# Altium project main.PrjPcb
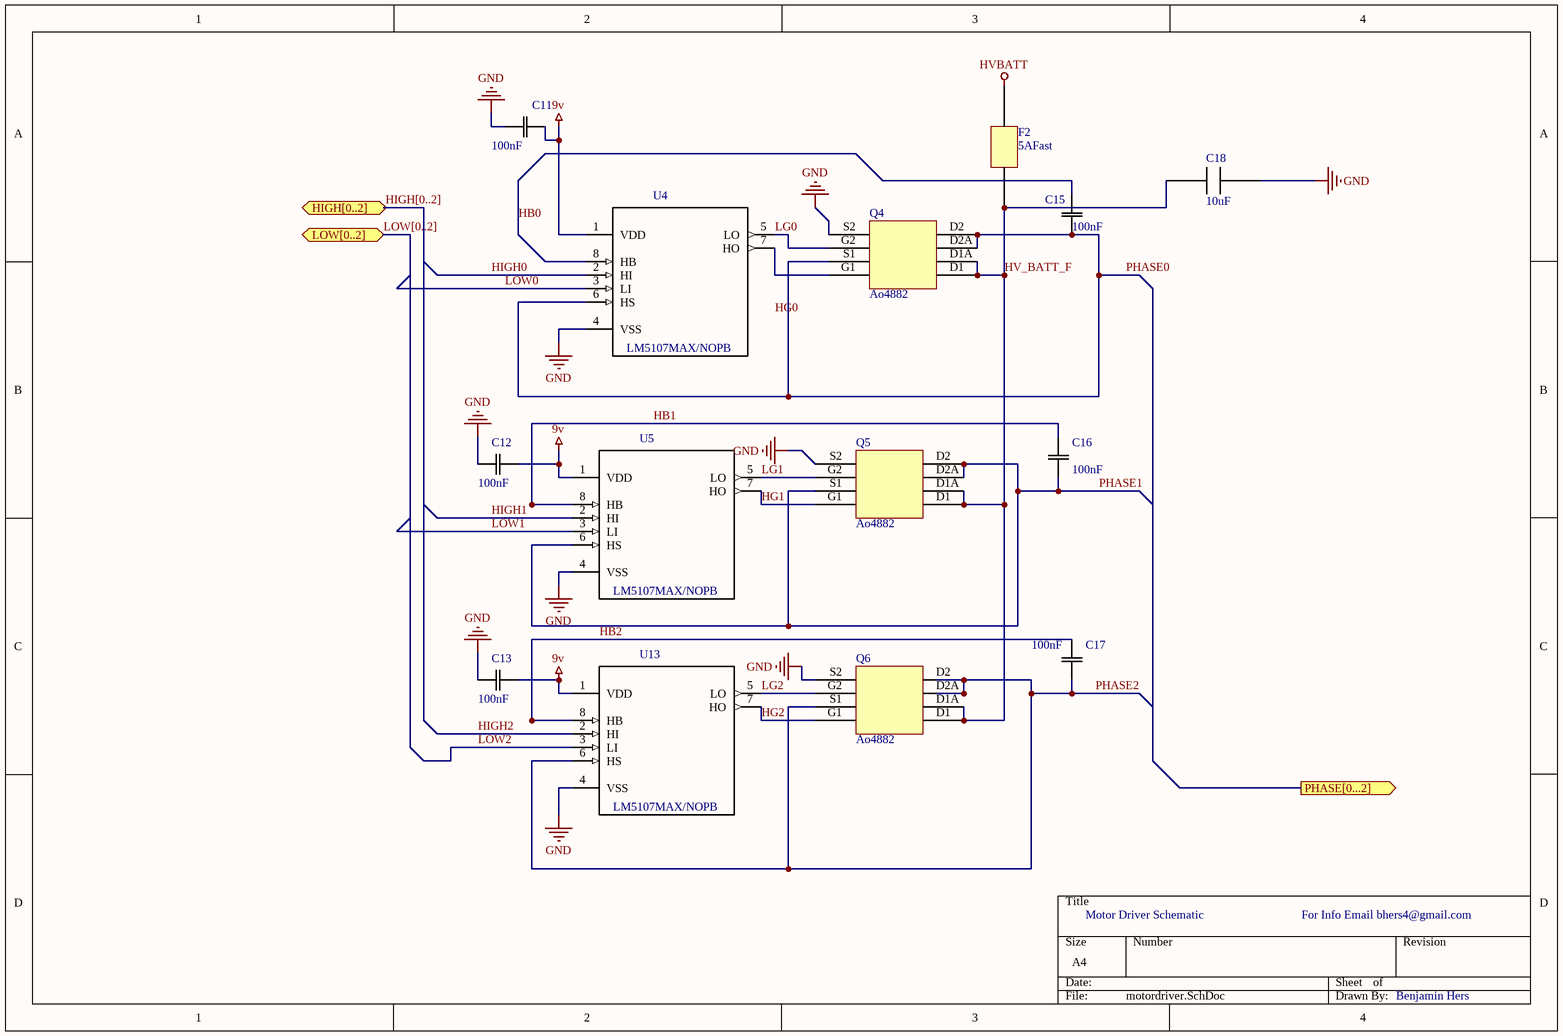
[diagram p0: motordriver.SchDoc]
3 sheets, 42 parts. Net scope: flat (ports and power ports of the same name join across sheets).
Board file: main.PcbDoc
Sheets:
  motordriver.SchDoc
  IMU.SchDoc
  microcontroller.SchDoc

## Sheet motordriver.SchDoc
size A4

### Parts
C11  100nF  [CAPC2013X110N]
C12  100nF  [CAPC2013X110N]
C13  100nF  [CAPC2013X110N]
C15  100nF  [CAPC2013X110N]
C16  100nF  [CAPC2013X110N]
C17  100nF  [CAPC2013X110N]
C18  10uF  [CAPC3216X100N]
F2  5AFast  [1206]
Q4  Ao4882  [SOIC127P490X600X175-8N]
Q5  Ao4882  [SOIC127P490X600X175-8N]
Q6  Ao4882  [SOIC127P490X600X175-8N]
U4  LM5107MAX/NOPB  [SOIC127P620X175-8N]
U5  LM5107MAX/NOPB  [SOIC127P620X175-8N]
U13  LM5107MAX/NOPB  [SOIC127P620X175-8N]

### Ports
HIGH[0..2] (in), LOW[0..2] (in), PHASE[0...2] (out)

### Nets
9v: C11.1(C1) C12.2(C2) C13.2(C2) U4.1(VDD) U5.1(VDD) U13.1(VDD)
GND: C11.2(C2) C12.1(C1) C13.1(C1) Q4.S2 Q5.S2 Q6.S2 U4.4(VSS) U5.4(VSS) U13.4(VSS)
HVBATT: F2.Fuseout(Out)
HB0: C15.2(C2) U4.8(HB)
HB1: C16.1(C1) U5.8(HB)
HB2: C17.1(C1) U13.8(HB)
HG1: Q5.G1 U5.7(HO)
HG2: Q6.G1 U13.7(HO)
HIGH0: U4.2(HI)
HIGH1: U5.2(HI)
HIGH2: U13.2(HI)
HV_BATT_F: F2.Fusein(In) Q4.D1 Q4.D1A Q5.D1 Q5.D1A Q6.D1 Q6.D1A
LG0: Q4.G2 U4.5(LO)
LG1: Q5.G2 U5.5(LO)
LG2: Q6.G2 U13.5(LO)
LOW0: U4.3(LI)
LOW1: U5.3(LI)
LOW2: U13.3(LI)
PHASE0: C15.1(C1) Q4.D2 Q4.D2A Q4.S1 U4.6(HS)
PHASE1: C16.2(C2) Q5.D2 Q5.D2A Q5.S1 U5.6(HS)
PHASE2: C17.2(C2) Q6.D2 Q6.D2A Q6.S1 U13.6(HS)
NetQ4_G1: Q4.G1 U4.7(HO)

Not connected (* = marked no-connect by the designer): C18 In Out

### Buses and harness runs
bus HIGH[0..2] = port HIGH[0..2]
bus LOW[0..2] = port LOW[0..2]

### Notes on the sheet
- Motor Driver Schematic
- For Info Email bhers4@gmail.com
- Benjamin Hers
- Labels drawn without touching a wire or pin: HG0

### Library data of the parts
C11-C13 C15-C17 = C0805C104K5RACTU: Capacitor; Ceramic; Cap; .100UF ; Tol+-10%; SMD; Vol-Rtg 50V; X7R, Tape/Reel; MF: Kemet; Package: 0805 Kemet; MP: C0805C104K5RACTU; Value: *
C18 = Component_1
F2 = 5AFast1206
U4 U5 U13 = LM5107MAX/NOPB: MOSFET DRVR 1.4A 2-OUT Hi/Lo Side Full Brdg/Half Brdg Non-Inv 8-Pin SOIC N T/R; MF: Texas Instruments; Digi-Key_Part_Number: LM5107MAX/NOPBCT-ND; MP: LM5107MAX/NOPB; Package: None; Digi-Key_Purchase_URL: https://www.digikey.ca/product-detail/en/texas-instruments/LM5107MAX-NOPB/LM5107MAX-NOPBCT-ND/3527005?WT.z_cid=ref_snapeda; Value: *

## Sheet IMU.SchDoc
size A4
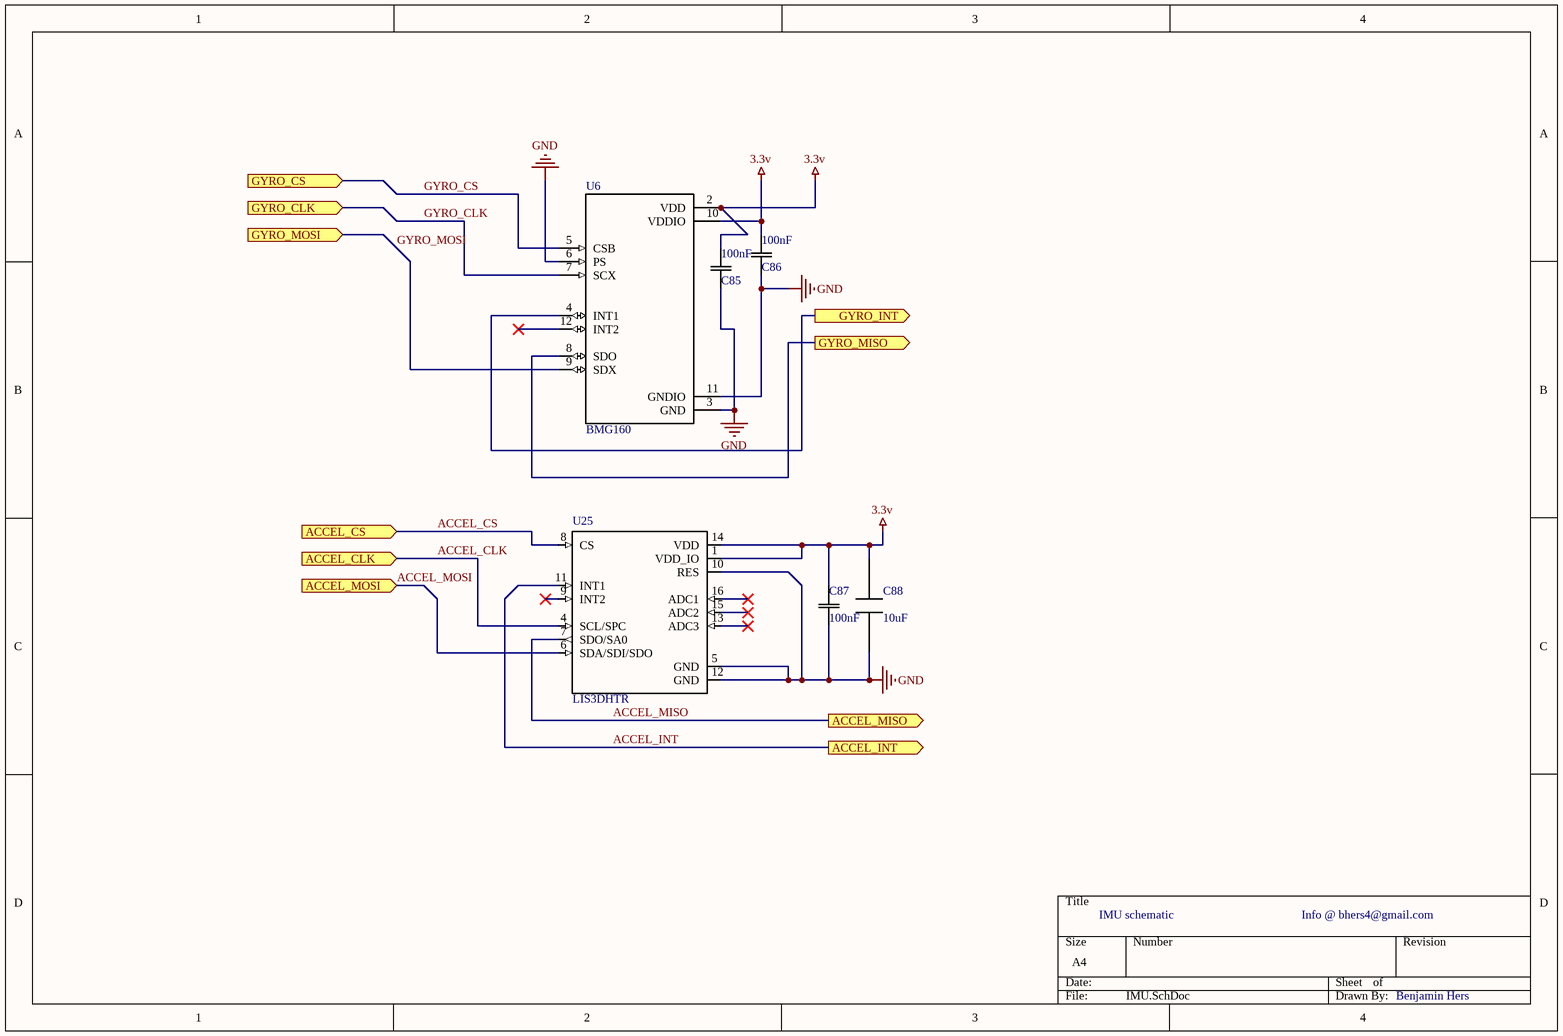
[diagram p1: IMU.SchDoc]

### Parts
C85  100nF  [CAPC2013X110N]
C86  100nF  [CAPC2013X110N]
C87  100nF  [CAPC2013X110N]
C88  10uF  [CAPC3216X100N]
U6  BMG160  [OFN50P300X300X100-12N]
U25  LIS3DHTR  [LGA16R50P5X3_300X300X100N]

### Ports
ACCEL_CLK (in), ACCEL_CS (in), ACCEL_INT (out), ACCEL_MISO (out), ACCEL_MOSI (in), GYRO_CLK (in), GYRO_CS (in), GYRO_INT (out), GYRO_MISO (out), GYRO_MOSI (in)

### Nets
3.3v: C85.1(C1) C86.1(C1) C87.2(C2) U6.2(VDD) U6.10(VDDIO) U25.1(VDD_IO) U25.14(VDD)
GND: C85.2(C2) C86.2(C2) C87.1(C1) U6.3(GND) U6.6(PS) U6.11(GNDIO) U25.5(GND) U25.10(RES) U25.12(GND)
ACCEL_CLK: U25.4(SCL/SPC) ; port ACCEL_CLK
ACCEL_CS: U25.8(CS) ; port ACCEL_CS
ACCEL_INT: U25.11(INT1) ; port ACCEL_INT
ACCEL_MISO: U25.7(SDO/SA0) ; port ACCEL_MISO
ACCEL_MOSI: U25.6(SDA/SDI/SDO) ; port ACCEL_MOSI
GYRO_CLK: U6.7(SCX) ; port GYRO_CLK
GYRO_CS: U6.5(CSB) ; port GYRO_CS
GYRO_MOSI: U6.9(SDX) ; port GYRO_MOSI
NetU6_4: U6.4(INT1) ; port GYRO_INT
NetU6_8: U6.8(SDO) ; port GYRO_MISO

Not connected (* = marked no-connect by the designer): C88 In Out; U6 12(INT2)*; U25 9(INT2)* 13(ADC3)* 15(ADC2)* 16(ADC1)*

### Notes on the sheet
- IMU schematic
- Info @ bhers4@gmail.com
- Benjamin Hers

### Library data of the parts
C85-C87 = C0805C104K5RACTU: as C11 on sheet motordriver; Package: 0805 Kemet; MP: C0805C104K5RACTU; Value: *
C88 = Component_1
U6 = BMG160: BMG160 Series 16 Bit 2000Â°/s 3-Axis Angular Rate Gyroscope Sensor 3 mm x 3 mm; MF: Bosch; MP: BMG160; Digi-Key_Purchase_URL: https://www.digikey.ca/product-detail/en/bosch-sensortec/BMG160/828-1042-1-ND/4196689?WT.z_cid=ref_snapeda; Package: VFLGA-12 Bosch; Digi-Key_Part_Number: 828-1042-1-ND; Value: *
U25 = LIS3DHTR: MEMS digital output motion sensor ultra low-power high performance 3-axes; MF: STMicroelectronics; Package: LGA-16 STMicroelectronics; MP: LIS3DHTR; Value: *

## Sheet microcontroller.SchDoc
size A4
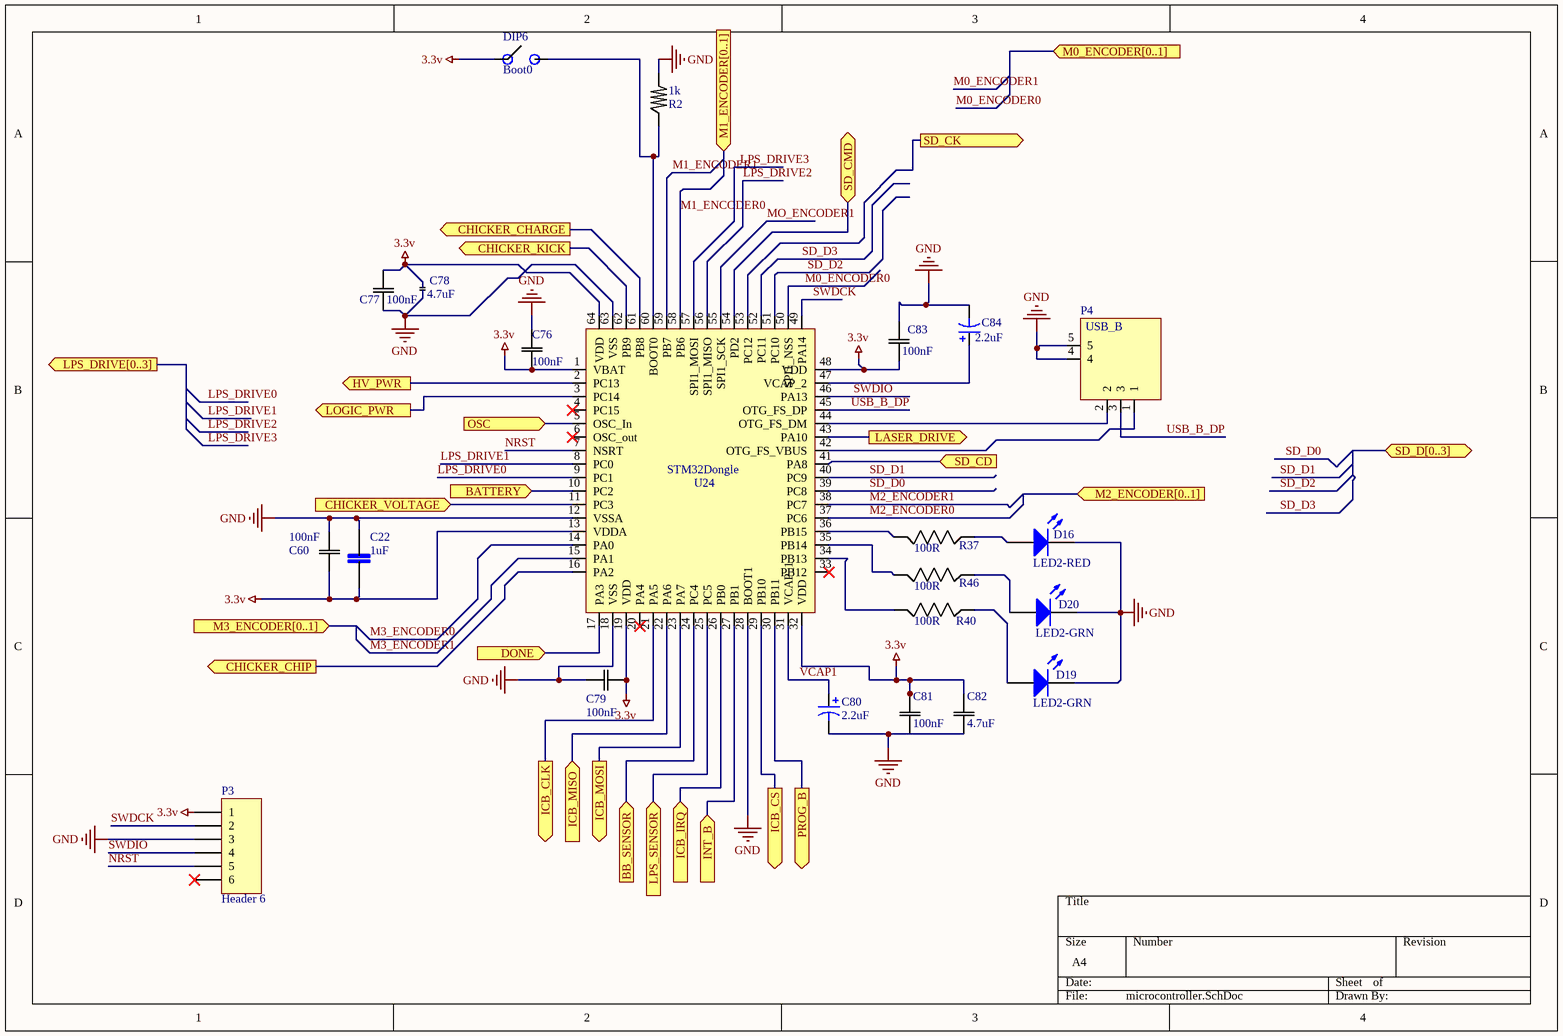
[diagram p2: microcontroller.SchDoc]

### Parts
1k  R2  [CAPC2012X140N]
C22  1uF  [INDC2012X87N]
C60  100nF  [CAPC2013X110N]
C76  100nF  [CAPC2013X110N]
C77  100nF  [CAPC2013X110N]
C78  4.7uF  [0805]
C79  100nF  [CAPC2013X110N]
C80  2.2uF  [C0805]
C81  100nF  [CAPC2013X110N]
C82  4.7uF  [CAPC2013X110N]
C83  100nF  [CAPC2013X110N]
C84  2.2uF  [C0805]
D16  LED2-RED  [3.2X1.6X1.1]
D19  LED2-GRN  [3.2X1.6X1.1]
D20  LED2-GRN  [3.2X1.6X1.1]
DIP6  Boot0  [SOJ254P980X912-12M]
P3  Header 6  [HDR1X6]
P4  USB_B  [PCBComponent_1]
R37  100R  [RESC2012X60]
R40  100R  [RESC2012X60]
R46  100R  [RESC2012X60]
STM32Dongle  U24  [QFP50P1200X1200X160-64N]

### Ports
BATTERY (in), BB_SENSOR (in), CHICKER_CHARGE (out), CHICKER_CHIP (out), CHICKER_KICK (out), CHICKER_VOLTAGE (in), DONE (in), HV_PWR (out), ICB_CLK (out), ICB_CS (out), ICB_IRQ (in), ICB_MISO (in), ICB_MOSI (out), INT_B (in), LASER_DRIVE (out), LOGIC_PWR (out), LPS_DRIVE[0..3] (out), LPS_SENSOR (in), M0_ENCODER[0..1] (in), M1_ENCODER[0..1] (in), M2_ENCODER[0..1] (in), M3_ENCODER[0..1] (in), OSC (in), PROG_B (out), SD_CD (in), SD_CK (out), SD_CMD (bidir), SD_D[0..3] (bidir)

### Nets
3.3v: C22.1 C60.1(C1) C76.1(C1) C77.2(C2) C78.P1 C79.2(C2) C81.2(C2) C82.2(C2) C83.1(C1) DIP6.12 P3.1 STM32Dongle.1(VBAT) STM32Dongle.13(VDDA) STM32Dongle.19(VDD) STM32Dongle.32(VDD) STM32Dongle.48(VDD) STM32Dongle.64(VDD)
GND: 1k.2 C22.2 C60.2(C2) C76.2(C2) C77.1(C1) C78.P2 C79.1(C1) C80.2 C81.1(C1) C82.1(C1) C83.2(C2) C84.2 D16.2(K) D19.2(K) D20.2(K) P3.3 P4.4 P4.5 STM32Dongle.12(VSSA) STM32Dongle.18(VSS) STM32Dongle.28(BOOT1) STM32Dongle.63(VSS)
LPS_DRIVE0: STM32Dongle.9(PC1)
LPS_DRIVE1: STM32Dongle.8(PC0)
LPS_DRIVE2: STM32Dongle.56(SPI1_MISO)
LPS_DRIVE3: STM32Dongle.57(SPI1_MOSI)
M0_ENCODER0: STM32Dongle.50(SPI1_NSS)
M1_ENCODER0: STM32Dongle.58(PB6)
M1_ENCODER1: STM32Dongle.59(PB7)
M2_ENCODER0: STM32Dongle.37(PC6)
M2_ENCODER1: STM32Dongle.38(PC7)
M3_ENCODER0: STM32Dongle.14(PA0)
M3_ENCODER1: STM32Dongle.15(PA1)
MO_ENCODER1: STM32Dongle.55(SPI1_SCK)
NRST: P3.5 STM32Dongle.7(NSRT)
SD_D0: STM32Dongle.39(PC8)
SD_D1: STM32Dongle.40(PC9)
SD_D2: STM32Dongle.51(PC10)
SD_D3: STM32Dongle.52(PC11)
SWDCK: P3.2 STM32Dongle.49(PA14)
SWDIO: P3.4 STM32Dongle.46(PA13)
USB_B_DP: P4.3 STM32Dongle.45(OTG_FS_DP)
VCAP1: C80.1 STM32Dongle.31(VCAP_1)
Net1k_1: 1k.1 DIP6.1 STM32Dongle.60(BOOT0)
NetC84_1: C84.1 STM32Dongle.47(VCAP_2)
NetD16_1: D16.1(A) R37.2
NetD19_1: D19.1(A) R40.2
NetD20_1: D20.1(A) R46.2
NetP4_1: P4.1 STM32Dongle.42(OTG_FS_VBUS)
NetP4_2: P4.2 STM32Dongle.44(OTG_FS_DM)
NetR37_1: R37.1 STM32Dongle.36(PB15)
NetR40_1: R40.1 STM32Dongle.34(PB13)
NetR46_1: R46.1 STM32Dongle.35(PB14)
NetSTM32Dongle_2: STM32Dongle.2(PC13) ; port HV_PWR
NetSTM32Dongle_3: STM32Dongle.3(PC14) ; port LOGIC_PWR
NetSTM32Dongle_5: STM32Dongle.5(OSC_In) ; port OSC
NetSTM32Dongle_10: STM32Dongle.10(PC2) ; port BATTERY
NetSTM32Dongle_11: STM32Dongle.11(PC3) ; port CHICKER_VOLTAGE
NetSTM32Dongle_16: STM32Dongle.16(PA2) ; port CHICKER_CHIP
NetSTM32Dongle_17: STM32Dongle.17(PA3) ; port DONE
NetSTM32Dongle_21: STM32Dongle.21(PA5) ; port ICB_CLK
NetSTM32Dongle_22: STM32Dongle.22(PA6) ; port ICB_MISO
NetSTM32Dongle_23: STM32Dongle.23(PA7) ; port ICB_MOSI
NetSTM32Dongle_24: STM32Dongle.24(PC4) ; port BB_SENSOR
NetSTM32Dongle_25: STM32Dongle.25(PC5) ; port LPS_SENSOR
NetSTM32Dongle_26: STM32Dongle.26(PB0) ; port ICB_IRQ
NetSTM32Dongle_27: STM32Dongle.27(PB1) ; port INT_B
NetSTM32Dongle_29: STM32Dongle.29(PB10) ; port ICB_CS
NetSTM32Dongle_30: STM32Dongle.30(PB11) ; port PROG_B
NetSTM32Dongle_41: STM32Dongle.41(PA8) ; port SD_CD
NetSTM32Dongle_43: STM32Dongle.43(PA10) ; port LASER_DRIVE
NetSTM32Dongle_53: STM32Dongle.53(PC12) ; port SD_CK
NetSTM32Dongle_54: STM32Dongle.54(PD2) ; port SD_CMD
NetSTM32Dongle_61: STM32Dongle.61(PB8) ; port CHICKER_CHARGE
NetSTM32Dongle_62: STM32Dongle.62(PB9) ; port CHICKER_KICK

Not connected (* = marked no-connect by the designer): P3 6*; STM32Dongle 4(PC15)* 6(OSC_out)* 20(PA4)* 33(PB12)*

### Library data of the parts
1k = 1kohm: 1276-5272-1-ND
C22 = C2012X5R1E105M085AC: CAP CER 1UF 25V X5R 0805; MF: TDK; Package: 0805 TDK; MP: C2012X5R1E105M085AC; Value: *
C60 C76 C77 = C0805C104K5RACTU: as C11 on sheet motordriver; Package: 0805 Kemet; MP: C0805C104K5RACTU; Value: *
C79 C81 = C0805C104K5RACTU: Capacitor; Ceramic; Cap; .100UF ; Tol+-10%; SMD; Vol-Rtg 50V; X7R, Tape/Reel; Value: 0.1uF; MF: KEMET; DP: 399-1170-1-ND; Tolerance: 10%; MP: C0805C104K5RACTU; Distributor: Digikey; DL: https://www.digikey.ca/; Datasheet Link: https://content.kemet.com/datasheets/KEM_C1002_X7R_SMD.pdf; Part Number: 399-1170-1-ND; Package: 0805 (2012 Metric); Rating: 50V
C80 = Cap Pol3: CAP CER 2.2UF 25V X7R 0805; MF: Samsung Electro-Mechanics; MP: CL21B225KAFNNWE; DP: 1276-2955-1-ND; Tolerance: 10%; Distributor: Digikey; DL: https://www.digikey.ca/; Value: 2.2uF; Rating: 25V; Datasheet Link: http://www.samsungsem.com/kr/support/product-search/mlcc/__icsFiles/afieldfile/2018/07/24/CL21B225KAFNNWE.pdf; Package: 0805 (2012 Metric)
C82 = C0805C104K5RACTU: CAP CER 4.7UF 25V X5R 0805; MF: Samsung Electro-Mechanics; MP: CL21A475KAQNNNE; DP: 1276-1244-1-ND; Tolerance: 10%; Value: 4.7uF; Distributor: Digikey; DL: https://www.digikey.ca/; Datasheet Link: http://www.samsungsem.com/kr/support/product-search/mlcc/__icsFiles/afieldfile/2018/06/20/CL21A475KAQNNNE.pdf; Part Number: 1276-1244-1-ND; Package: 0805 (2012 Metric); Rating: 25V
C83 = C0805C104K5RACTU: 0.1µF ±10% 50V Ceramic Capacitor X7R 0805 (2012 Metric)l; MF: Kemet; Value: 0.1uF; DP: 399-1170-1-ND; Package: 0805 (2012 Metric); MP: C0805C104K5RACTU; Distributor: Digikey; Tolerance: 10%; Rating: 50V; DL: https://www.digikey.ca/product-detail/en/kemet/C0805C104K5RACTU/399-1170-1-ND/411445; Datasheet Link: https://content.kemet.com/datasheets/KEM_C1002_X7R_SMD.pdf; Dielectric: X7R
C84 = Cap Pol3: 2.2µF ±10% 25V Ceramic Capacitor X7R 0805 (2012 Metric); DP: 1276-2955-1-ND; MF: Samsung Electro-Mechanics; MP: CL21B225KAFNNWE; Value: 2.2uF; DL: www.digikey.ca; Rating: 25V; Tolerance: 10%; Package: 0805 (2012 Metric); Part Number: 1276-2955-1-ND; Datasheet Link: http://www.samsungsem.com/kr/support/product-search/mlcc/__icsFiles/afieldfile/2018/07/24/CL21B225KAFNNWE.pdf
D16 = LED2: LED GREEN CLEAR 1206 SMD; Part Number: 160-1167-1-ND; MF: Lite-On Inc.; MP: LTST-C150CKT; Distributor: Digikey; DP: 160-1167-1-ND; DL: https://www.digikey.ca/products/en?keywords=160-1167-1-ND; Datasheet Link: http://optoelectronics.liteon.com/upload/download/DS-22-98-0004/LTST-C150GKT.pdf; Package: 1206 (3216 Metric); Tolerance: N/A; Value: Green; Rating: N/A
D19 D20 = LED2: LED GREEN CLEAR 1206 SMD; Part Number: 160-1169-1-ND; MF: Lite-On Inc.; MP: LTST-C150GKT; Distributor: Digikey; DP: 160-1169-1-ND; DL: https://www.digikey.ca/products/en?keywords=160-1169-1-ND; Datasheet Link: http://optoelectronics.liteon.com/upload/download/DS-22-98-0004/LTST-C150GKT.pdf; Package: 1206 (3216 Metric); Tolerance: N/A; Value: Green; Rating: N/A
P3 = Header 6: Header, 6-Pin; LatestRevisionDate: 17-Jul-2002; LatestRevisionNote: Re-released for DXP Platform.; Publisher: Altium Limited
P4 = Component_1: DP: ED2980-ND; MF: On Shore Technology Inc.; MP: USB-B1KSW6; Rating: 1A; DL: https://www.digikey.ca/; Package: N/A; Part Number: ED2980-ND; Distributor: Digikey; Datasheet Link: http://www.on-shore.com/wp-content/uploads/2015/09/usb-b1ksxx.pdf; Value: USB_B; Tolerance: N/A
R37 R46 = RC0805FR-07100RL: RES SMD 100 OHM 1% 1/8W 0805; Part Number: 1276-5224-1-ND; MP: RC2012F101CS; MF: Samsung Electro-Mechanics; Package: 0805 (2012 Metric); Value: 100R; Distributor: Digikey; DP: 1276-5224-1-ND; Tolerance: 1%; Rating: 1/8W
  R46: DL: www.digikey.ca
R40 = RC0805FR-07100RL: RES SMD 100 OHM 1% 1/8W 0805; MP: RC2012F101CS; MF: Samsung Electro-Mechanics; DP: 1276-5224-1-ND; Package: 0805 (2012 Metric); Value: 100R; Tolerance: 1%; Rating: 1/8W; DL: https://www.digikey.ca/product-detail/en/samsung-electro-mechanics/RC2012F101CS/1276-5224-1-ND/3968196
STM32Dongle = STM32Dongle: 497-11907-ND; MF: STMicroelectronics; MP: STM32F415RGT6; Rating: 3.3V; DP: 497-11907-ND; Distributor: Digikey; Datasheet Link: https://www.st.com/content/ccc/resource/technical/document/datasheet/98/9f/89/73/01/b1/48/98/DM00035129.pdf/files/DM00035129.pdf/jcr:content/translations/en.DM00035129.pdf; DL: https://www.digikey.ca/; Package: 64-LQFP; Tolerance: N/A; Value: N/A

## Nets that join several sheets
3.3v: IMU (7 pins), microcontroller (17 pins)
GND: motordriver (9 pins), IMU (9 pins), microcontroller (22 pins)